# EAGLE design rpi_ad7705-2 (EAGLE 7.5.0)
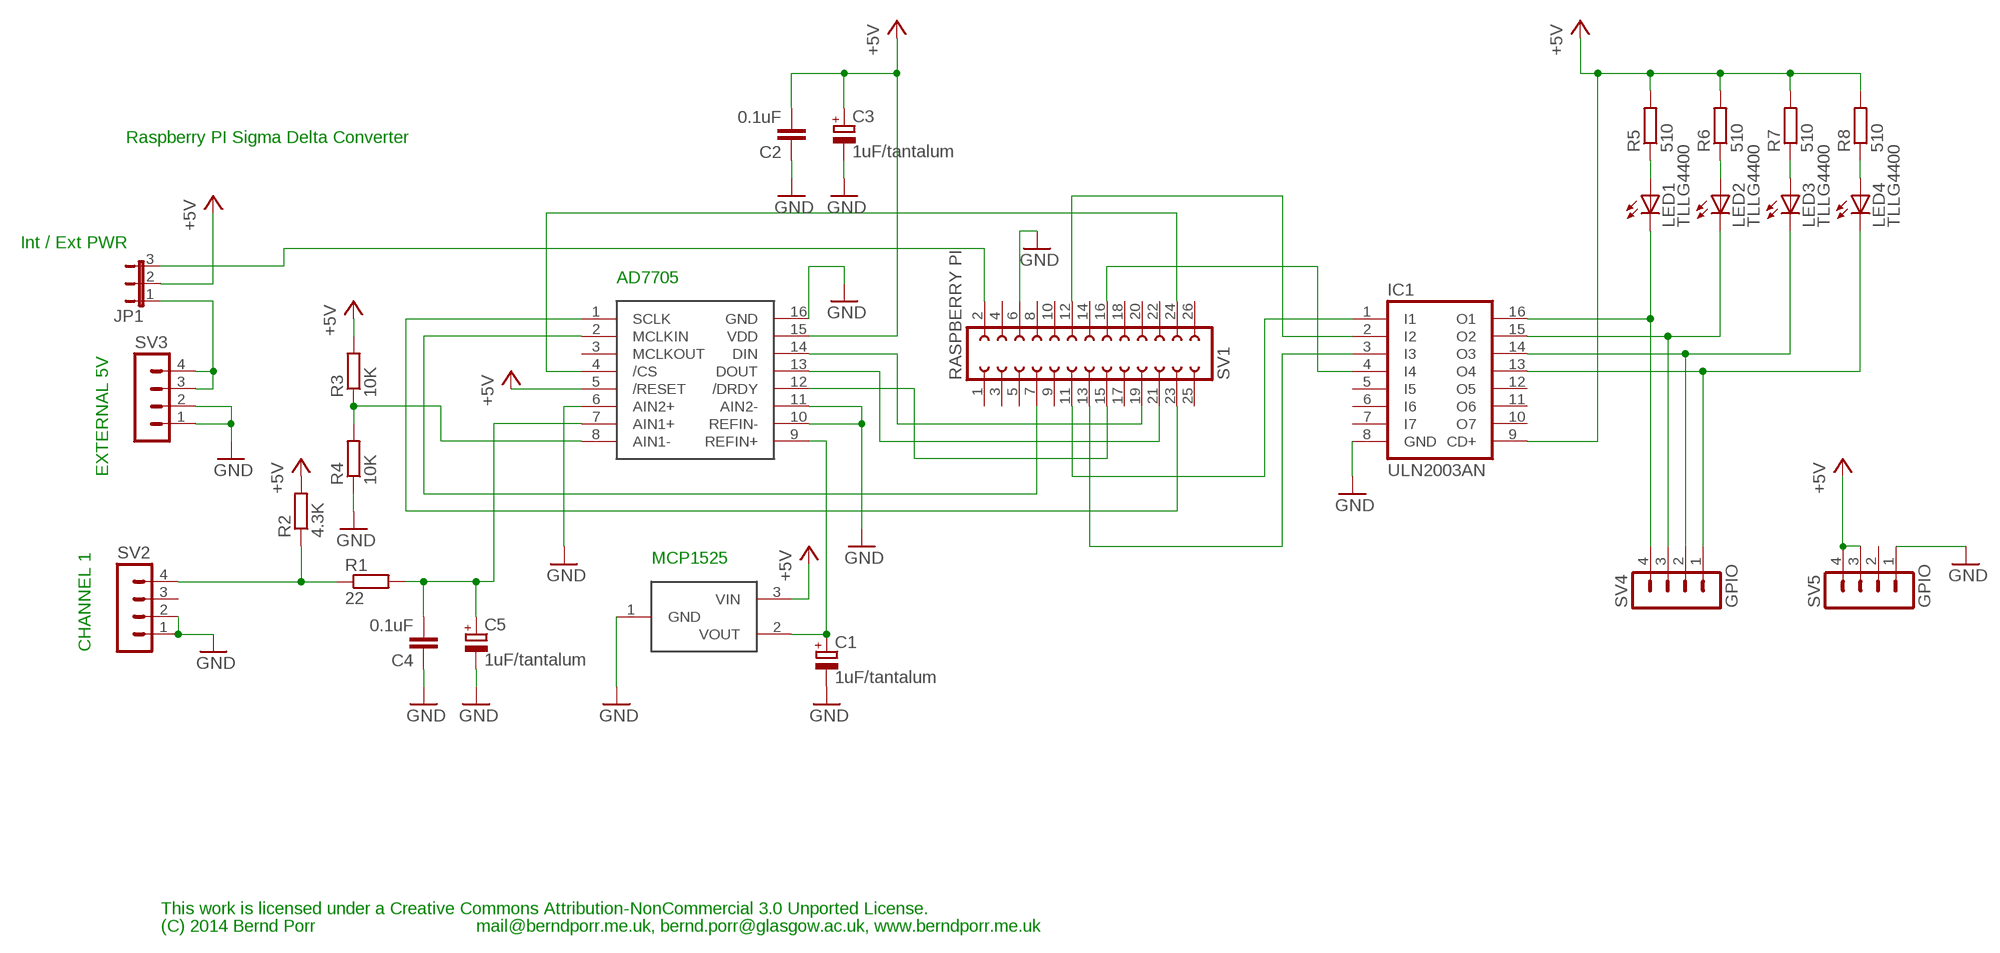
[diagram p0: schematic, sheet 1]

## Parts
C1  1uF/tantalum  CPOL-EUTT2D7  [TT2D7]
C2  0.1uF  C5/2.5  [C5B2.5]
C3  1uF/tantalum  CPOL-EUTT2D7  [TT2D7]
C4  0.1uF  C5/2.5  [C5B2.5]
C5  1uF/tantalum  CPOL-EUTT2D7  [TT2D7]
IC1  ULN2003AN  [DIL16]
JP1  JP2E  [JP2]
LED1  TLLG4400  [LED3MM]
LED2  TLLG4400  [LED3MM]
LED3  TLLG4400  [LED3MM]
LED4  TLLG4400  [LED3MM]
R1  22  R-EU_0207/10  [0207/10]
R2  4.3K  R-EU_0207/10  [0207/10]
R3  10K  R-EU_0207/10  [0207/10]
R4  10K  R-EU_0207/10  [0207/10]
R5  510  R-EU_0207/10  [0207/10]
R6  510  R-EU_0207/10  [0207/10]
R7  510  R-EU_0207/10  [0207/10]
R8  510  R-EU_0207/10  [0207/10]
SV1  RASPBERRY PI  FE13-2  [FE13-2]
SV2  MA04-1  [MA04-1]
SV3  MA04-1  [MA04-1]
SV4  GPIO  MA04-1  [MA04-1]
SV5  GPIO  MA04-1  [MA04-1]
U$1  AD7705  [DIP16]
U$2  MCP1525  [TO92]

## Nets
+5V: C2.2 C3.+ IC1.9(CD+) JP1.2 R2.2 R3.2 R5.2 R6.2 R7.2 R8.2 SV5.3 SV5.4 U$1.5(/RESET) U$1.15(VDD) U$2.3(VIN)
GND: C1.- C2.1 C3.- C4.1 C5.- IC1.8(GND) R4.1 SV1.6 SV2.1 SV2.2 SV3.1 SV3.2 SV5.1 U$1.6(AIN2+) U$1.10(REFIN-) U$1.11(AIN2-) U$1.16(GND) U$2.1(GND)
N$1: SV1.19 U$1.14(DIN)
N$2: SV1.23 U$1.1(SCLK)
N$3: SV1.7 U$1.2(MCLKIN)
N$4: SV1.24 U$1.4(/CS)
N$5: C1.+ U$1.9(REFIN+) U$2.2(VOUT)
N$6: SV1.21 U$1.13(DOUT)
N$7: R3.1 R4.2 U$1.8(AIN1-)
N$8: C4.2 C5.+ R1.2 U$1.7(AIN1+)
N$9: IC1.1(I1) SV1.11
N$10: IC1.3(I3) SV1.13
N$11: R1.1 R2.1 SV2.4
N$12: IC1.2(I2) SV1.12
N$13: IC1.4(I4) SV1.16
N$14: JP1.1 SV3.3 SV3.4
N$15: LED1.A R5.1
N$16: LED2.A R6.1
N$17: IC1.16(O1) LED1.K(C) SV4.4
N$18: LED3.A R7.1
N$19: LED4.A R8.1
N$20: IC1.15(O2) LED2.K(C) SV4.3
N$21: SV1.15 U$1.12(/DRDY)
N$22: JP1.3 SV1.2
N$23: IC1.14(O3) LED3.K(C) SV4.2
N$24: IC1.13(O4) LED4.K(C) SV4.1
Unconnected: IC1.5(I5) IC1.6(I6) IC1.7(I7) IC1.10(O7) IC1.11(O6) IC1.12(O5) SV1.1 SV1.3 SV1.4 SV1.5 SV1.8 SV1.9 SV1.10 SV1.14 SV1.17 SV1.18 SV1.20 SV1.22 SV1.25 SV1.26 SV2.3 SV5.2 U$1.3(MCLKOUT)

## Notes on the sheet
- Raspberry PI Sigma Delta Converter
- Int / Ext PWR
- AD7705
- EXTERNAL 5V
- MCP1525
- CHANNEL 1
- This work is licensed under a Creative Commons Attribution-NonCommercial 3.0 Unported License.
- (C) 2014 Bernd Porr | mail@berndporr.me.uk, bernd.porr@glasgow.ac.uk, www.berndporr.me.uk

## Library data of the parts
C1 C3 C5 = rcl:CPOL-EU: POLARIZED CAPACITOR, European symbol
C2 C4 = capacitor-wima:C: CAPACITOR naming: grid - package width
IC1 = uln-udn:ULN2003A: DRIVER ARRAY
JP1 = jumper:JP2E: JUMPER
LED1-LED4 = led:TLLG4400: Low Current (2mA) LED 3 mm Tinted Diffused Package color GREEN Source: Data sheet <http://www.farnell.com/datasheets/391098.pdf>; MF: VISHAY SEMICONDUCTOR; OC_FARNELL: 1612435
R1-R8 = resistor:R-EU_: RESISTOR, European symbol
SV1 = con-lsta:FE13-2: FEMALE HEADER; OC_FARNELL: unknown; OC_NEWARK: unknown
SV2-SV5 = con-lstb:MA04-1: PIN HEADER; OC_FARNELL: unknown; OC_NEWARK: unknown
U$1 = rpi:AD7705
U$2 = rpi:MCP1525

## Board
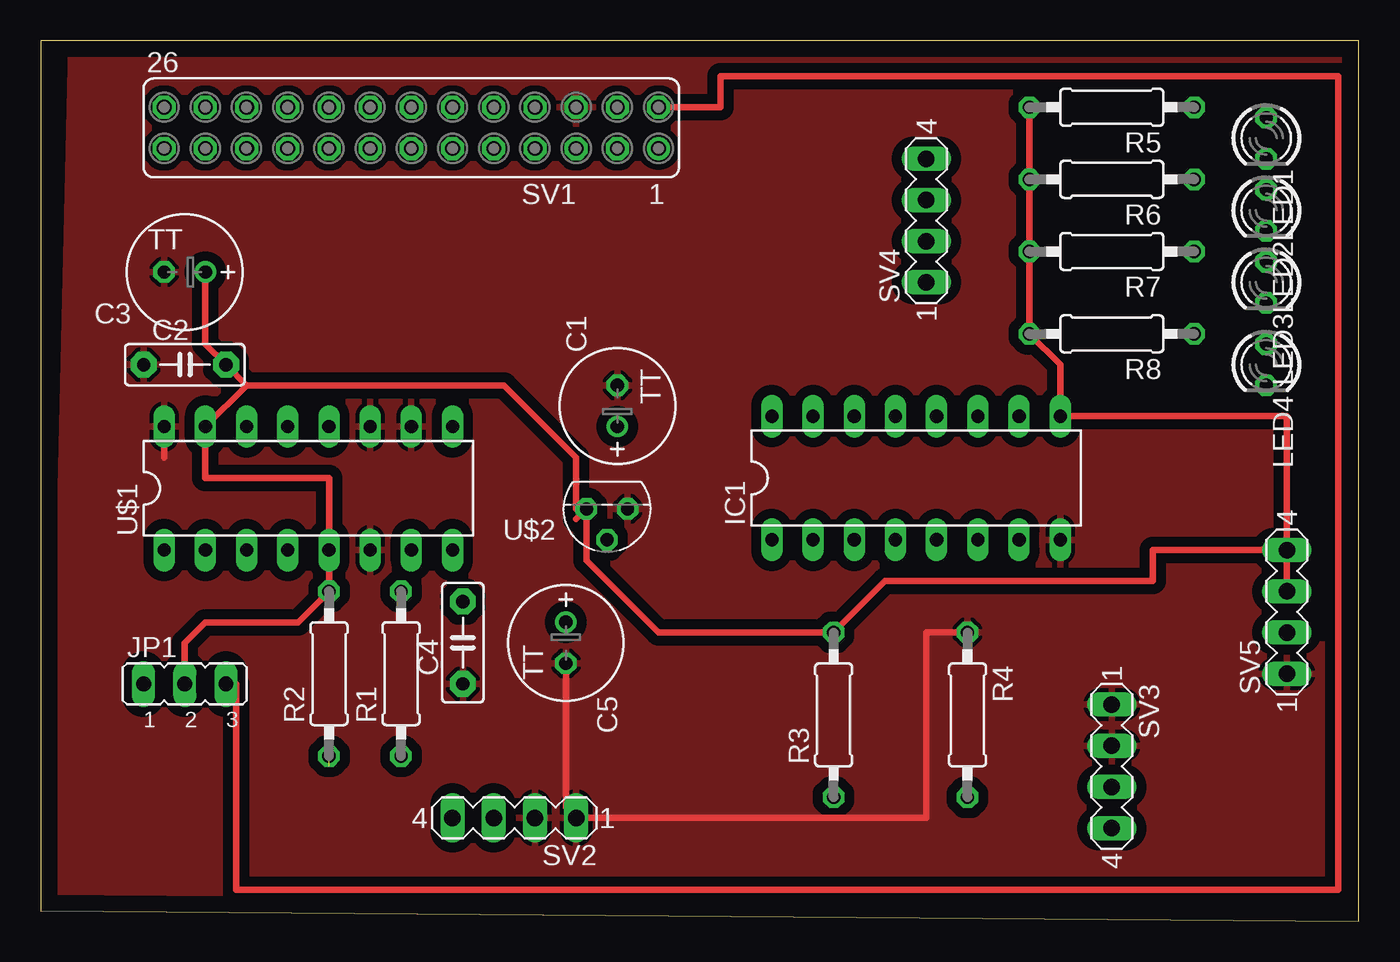
[diagram p1: board, top side]
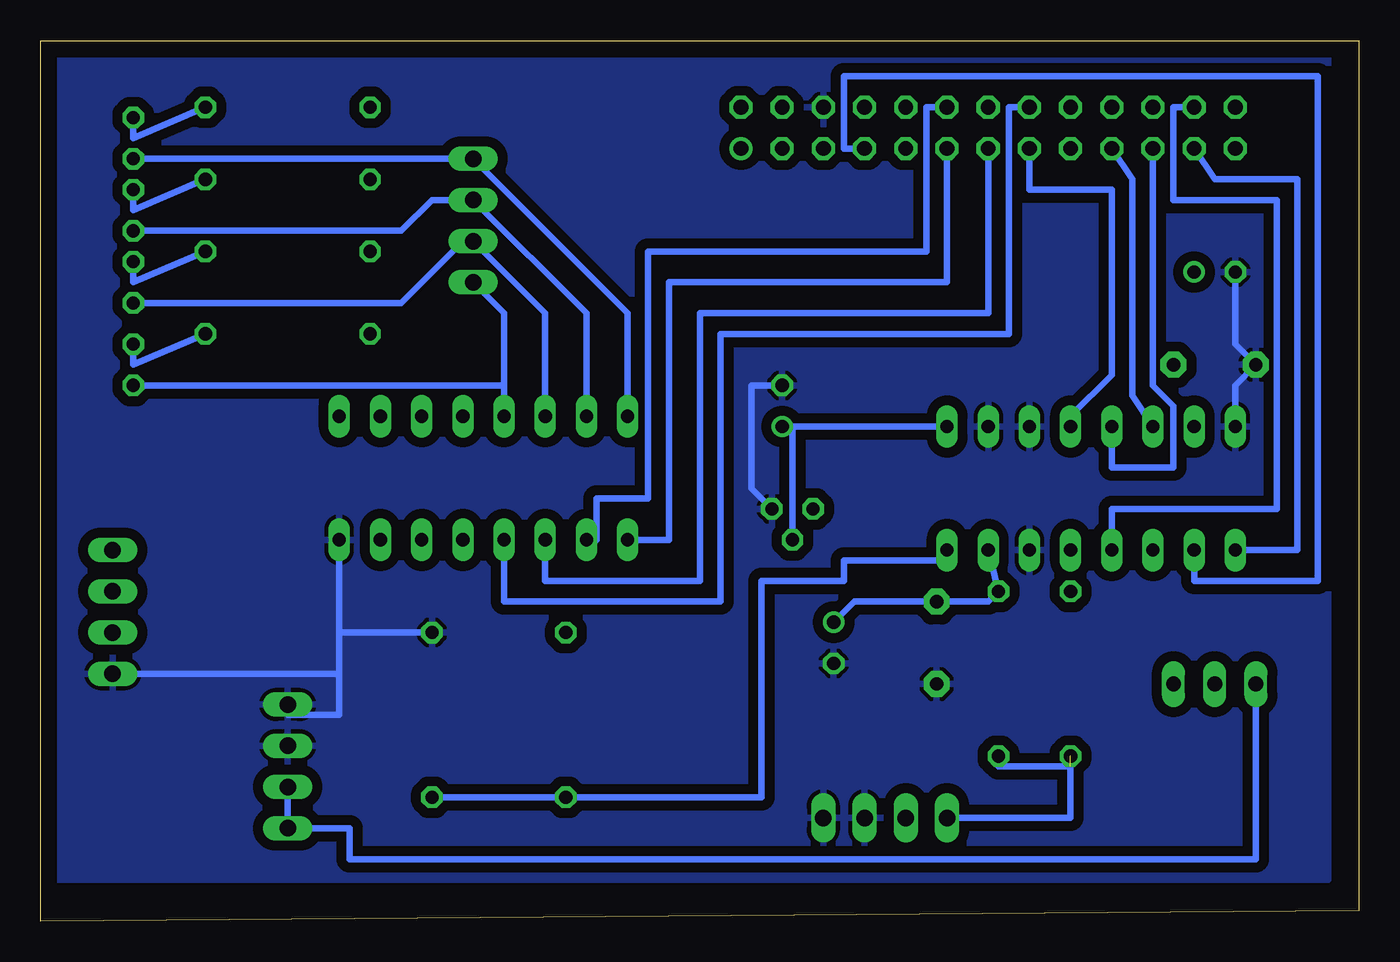
[diagram p2: board, bottom side, seen from below]

Size 81.28 x 54.3 mm. Coordinates in mm from the lower left corner, seen from the top.
Outline: 0,0.66 81.28,0 81.26,54.3 0,54.3 0,0.66
Copper layers (1*16): Top 0.035mm / dielectric 1.5mm / Bottom 0.035mm
Design rules "default": minimum track width 10mil, minimum drill 24mil, track to track 8mil, track to pad 8mil, pad to pad 8mil, via to via 8mil, smd to smd 8mil, copper to edge 40mil, drill to drill 8mil, minimum pad ring 10mil, minimum via ring 8mil, stop-mask expansion 4mil, vias tented up to drill 0mil, thermal gap 10mil

### Footprints (pad centres in the part's own frame; a part is rotated, then mirrored left to right if it is on the bottom)
TT2D7 = drill 0.813: + -1.27,0 | drill 0.813 octagon: - 1.27,0
C5B2.5 = drill 0.813 pad 1.6 octagon: 1 -2.54,0; 2 2.54,0
DIL16 = drill 0.813 long: 1 -8.89,-3.81; 2 -6.35,-3.81; 3 -3.81,-3.81; 4 -1.27,-3.81; 5 1.27,-3.81; 6 3.81,-3.81; 7 6.35,-3.81; 8 8.89,-3.81; 9 8.89,3.81; 10 6.35,3.81; 11 3.81,3.81; 12 1.27,3.81; 13 -1.27,3.81; 14 -3.81,3.81; 15 -6.35,3.81; 16 -8.89,3.81
JP2 = drill 0.914 long: 1 -2.54,0; 2 0,0; 3 2.54,0
LED3MM = drill 0.813 octagon: A -1.27,0; K 1.27,0
0207/10 = drill 0.813 octagon: 1 -5.08,0; 2 5.08,0
FE13-2 = drill 0.914: 1 -15.24,1.27 | drill 0.914 octagon: 2 -15.24,-1.27; 3 -12.7,1.27; 4 -12.7,-1.27; 5 -10.16,1.27; 6 -10.16,-1.27; 7 -7.62,1.27; 8 -7.62,-1.27; 9 -5.08,1.27; 10 -5.08,-1.27; 11 -2.54,1.27; 12 -2.54,-1.27; 13 0,1.27; 14 0,-1.27; 15 2.54,1.27; 16 2.54,-1.27; 17 5.08,1.27; 18 5.08,-1.27; 19 7.62,1.27; 20 7.62,-1.27; 21 10.16,1.27; 22 10.16,-1.27; 23 12.7,1.27; 24 12.7,-1.27; 25 15.24,1.27; 26 15.24,-1.27
MA04-1 = drill 1.016 long: 1 -3.81,0; 2 -1.27,0; 3 1.27,0; 4 3.81,0
DIP16 = drill 0.813 long: 1 -8.89,-3.81; 2 -6.35,-3.81; 3 -3.81,-3.81; 4 -1.27,-3.81; 5 1.27,-3.81; 6 3.81,-3.81; 7 6.35,-3.81; 8 8.89,-3.81; 9 8.89,3.81; 10 6.35,3.81; 11 3.81,3.81; 12 1.27,3.81; 13 -1.27,3.81; 14 -3.81,3.81; 15 -6.35,3.81; 16 -8.89,3.81
TO92 = drill 0.813 octagon: 1 -3.81,0; 2 -2.54,1.905; 3 -1.27,0

### Placement (x,y rotation side)
C1  35.56,31.77 90 top
C2  8.89,34.31 0 top
C3  8.89,40.02 180 top
C4  26.04,17.16 90 top
C5  32.38,17.16 270 top
IC1  53.98,27.32 0 top
JP1  8.89,14.62 0 top
LED1  75.57,48.28 270 top
LED2  75.57,43.84 270 top
LED3  75.57,39.39 270 top
LED4  75.57,34.31 270 top
R1  22.23,15.26 90 top
R2  17.78,15.26 90 top
R3  48.89,12.72 90 top
R4  57.15,12.72 270 top
R5  66.04,50.19 180 top
R6  66.04,45.74 180 top
R7  66.04,41.3 180 top
R8  66.04,36.21 180 top
SV1  22.86,48.91 180 top
SV2  29.21,6.37 180 top
SV3  66.04,9.55 270 top
SV4  54.61,43.2 90 top
SV5  76.84,19.07 90 top
U$1  16.51,26.69 0 top
U$2  32.38,25.42 180 top

### Tracks (layer width: path | path; a pad name or v marks a point on that pad's centre or on a via)
+5V
  Top 0.406: U$2.3 33.02,25.42 33.02,28.59 28.58,33.04 12.7,33.04 | 33.02,24.79 U$2.3 | SV5.4 76.84,31.13 IC1.9 62.86,34.31 R8.2 R7.2 R6.2 R5.2 | SV5.4 68.58,22.88 68.58,20.97 52.07,20.97 R3.2 38.1,17.8 33.66,22.24 U$2.3 | SV5.3 SV5.4 | 12.7,33.04 C2.2 10.16,35.58 C3.+ | JP1.2 8.89,17.16 10.16,18.43 15.88,18.43 R2.2 U$1.5 17.78,27.32 10.16,27.32 U$1.15 12.7,33.04
GND
  Top 0.406: 7.62,28.59 U$1.16 | 32.38,14.62 C5.- 32.38,7 SV2.1 54.61,6.37 54.61,17.8 R4.1
  Bottom 0.406: SV5.1 62.86,15.26 | R4.1 62.86,17.8 | C3.- 7.62,35.58 C2.1 7.62,33.04 U$1.16 | U$2.1 37.46,26.69 37.46,33.04 C1.- | IC1.8 62.86,17.8 | 62.86,17.8 62.86,15.26 | 62.86,15.26 62.86,12.72 66.04,12.72 SV3.1
  pour Bottom (isolate 0.61): 1.91,53.99 80.65,53.99 81.28,2.56 1.91,2.56
  pour Top (isolate 0.61): 1.91,53.99 80.65,53.99 80.01,0.66 0.64,0.66
N$1
  Bottom 0.406: U$1.14 13.97,32.41 13.97,45.74 SV1.19
N$2
  Bottom 0.406: U$1.1 3.81,22.88 3.81,45.74 8.89,45.74 SV1.23
N$3
  Bottom 0.406: SV1.7 31.75,47.64 31.75,52.09 2.54,52.09 2.54,20.97 10.16,20.97 U$1.2
N$4
  Bottom 0.406: SV1.24 11.43,50.19 11.43,44.47 5.08,44.47 5.08,25.42 15.24,25.42 U$1.4
N$5
  Bottom 0.406: 34.92,30.5 U$1.9 | U$2.2 34.92,30.5 | 34.92,30.5 C1.+
N$6
  Bottom 0.406: U$1.13 15.24,27.96 11.43,27.96 11.43,31.77 12.7,33.04 SV1.21
N$7
  Bottom 0.406: R4.2 R3.1 36.83,7.64 36.83,20.97 31.75,20.97 31.75,22.24 25.4,22.24 U$1.8
N$8
  Bottom 0.406: U$1.7 R1.2 22.86,19.7 C4.2 31.12,19.7 C5.+
N$9
  Bottom 0.406: IC1.1 42.54,23.52 42.54,39.39 25.4,39.39 SV1.11
N$10
  Bottom 0.406: SV1.13 22.86,37.48 40.64,37.48 40.64,20.97 50.16,20.97 IC1.3
N$11  (1 unrouted)
  Bottom 0.406: SV2.4 17.78,6.37 17.78,9.55 22.23,9.55 R1.1
N$12
  Bottom 0.406: IC1.2 46.99,23.52 46.99,26.05 43.81,26.05 43.81,41.3 26.67,41.3 26.67,50.19 SV1.12
N$13
  Bottom 0.406: IC1.4 52.7,19.7 39.37,19.7 39.37,36.21 21.59,36.21 21.59,50.19 SV1.16
N$14
  Bottom 0.406: JP1.1 6.35,3.83 62.23,3.83 62.23,5.74 SV3.4 SV3.3
N$15
  Bottom 0.406: R5.1 75.57,48.28 LED1.A
N$16
  Bottom 0.406: R6.1 75.57,43.84 LED2.A
N$17
  Bottom 0.406: LED1.K SV4.4 45.09,37.48 IC1.16
N$18
  Bottom 0.406: R7.1 75.57,39.39 LED3.A
N$19
  Bottom 0.406: R8.1 75.57,34.31 LED4.A
N$20
  Bottom 0.406: IC1.15 47.62,37.48 SV4.3 57.15,44.47 59.05,42.56 LED2.K
N$21
  Bottom 0.406: U$1.12 17.78,31.13 15.24,33.67 15.24,45.1 20.32,45.1 SV1.15
N$22
  Top 0.406: JP1.3 12.06,14.62 12.06,1.93 80.01,1.93 80.01,52.09 41.91,52.09 41.91,50.19 SV1.2
N$23
  Bottom 0.406: IC1.14 50.16,37.48 SV4.2 55.24,41.93 59.05,38.12 LED3.K
N$24
  Bottom 0.406: LED4.K 52.7,33.04 | 52.7,33.04 52.7,31.77 IC1.13 | SV4.1 52.7,37.48 52.7,33.04